# EAGLE schematic v2164 quad VCA (EAGLE 9.5.2)
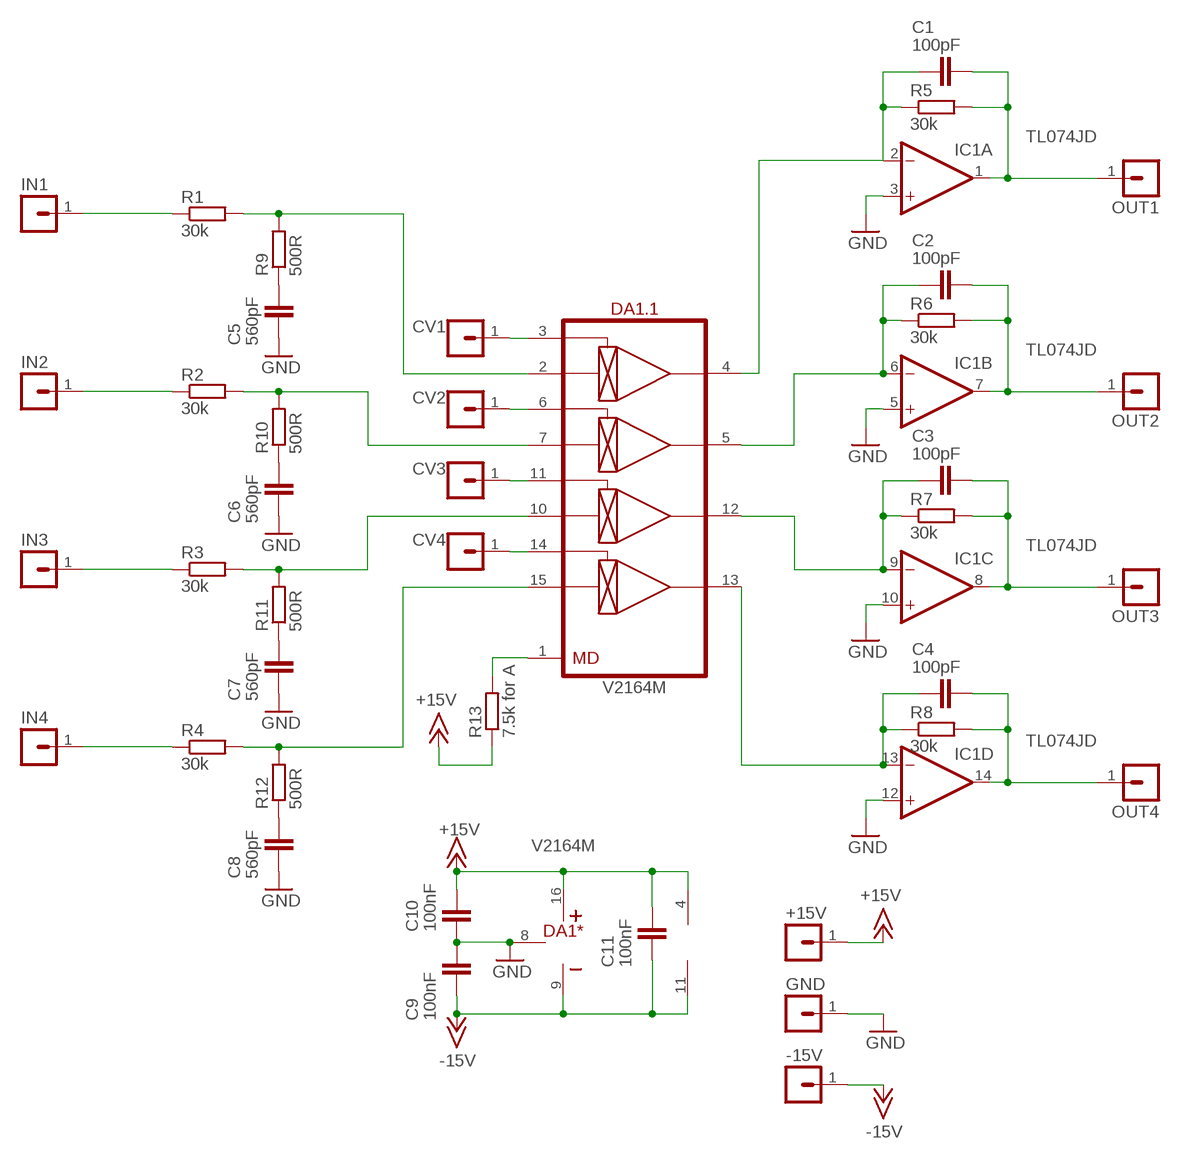
[diagram p0: schematic, sheet 1]

## Parts
+15V  MA01-1JN  [MA01N-1J]
-15V  MA01-1JN  [MA01N-1J]
C1  100pF  C-EUC0603  [C0603]
C2  100pF  C-EUC0603  [C0603]
C3  100pF  C-EUC0603  [C0603]
C4  100pF  C-EUC0603  [C0603]
C5  560pF  C-EUC0603  [C0603]
C6  560pF  C-EUC0603  [C0603]
C7  560pF  C-EUC0603  [C0603]
C8  560pF  C-EUC0603  [C0603]
C9  100nF  C-EUC0603  [C0603]
C10  100nF  C-EUC0603  [C0603]
C11  100nF  C-EUC0603  [C0603]
CV1  MA01-1JN  [MA01N-1J]
CV2  MA01-1JN  [MA01N-1J]
CV3  MA01-1JN  [MA01N-1J]
CV4  MA01-1JN  [MA01N-1J]
DA1  V2164M  [SO-16]
GND  MA01-1JN  [MA01N-1J]
IC1  TL074JD  [SO14J]
IN1  MA01-1JN  [MA01N-1J]
IN2  MA01-1JN  [MA01N-1J]
IN3  MA01-1JN  [MA01N-1J]
IN4  MA01-1JN  [MA01N-1J]
OUT1  MA01-1JN  [MA01N-1J]
OUT2  MA01-1JN  [MA01N-1J]
OUT3  MA01-1JN  [MA01N-1J]
OUT4  MA01-1JN  [MA01N-1J]
R1  30k  R-EU_R0603  [R0603]
R2  30k  R-EU_R0603  [R0603]
R3  30k  R-EU_R0603  [R0603]
R4  30k  R-EU_R0603  [R0603]
R5  30k  R-EU_R0603  [R0603]
R6  30k  R-EU_R0603  [R0603]
R7  30k  R-EU_R0603  [R0603]
R8  30k  R-EU_R0603  [R0603]
R9  500R  R-EU_R0603  [R0603]
R10  500R  R-EU_R0603  [R0603]
R11  500R  R-EU_R0603  [R0603]
R12  500R  R-EU_R0603  [R0603]
R13  7.5k for A  R-EU_R0603  [R0603]

## Nets
+15V: +15V.1 C10.2 C11.2 DA1.16(*:V+) IC1.4(P:V+) R13.1
-15V: -15V.1 C9.1 C11.1 DA1.9(*:V-) IC1.11(P:V-)
CV1: CV1.1 DA1.3(.1:CV1)
CV2: CV2.1 DA1.6(.1:CV2)
CV3: CV3.1 DA1.11(.1:CV3)
CV4: CV4.1 DA1.14(.1:CV4)
GND: C5.1 C6.1 C7.1 C8.1 C9.2 C10.1 DA1.8(*:GND) GND.1 IC1.3(A:+IN) IC1.5(B:+IN) IC1.10(C:+IN) IC1.12(D:+IN)
IN1: IN1.1 R1.1
IN2: IN2.1 R2.1
IN3: IN3.1 R3.1
IN4: IN4.1 R4.1
N$1: C4.1 DA1.13(.1:OUT4) IC1.13(D:-IN) R8.1
N$2: DA1.1(.1:MD) R13.2
N$3: C3.1 DA1.12(.1:OUT3) IC1.9(C:-IN) R7.1
N$5: C2.1 DA1.5(.1:OUT2) IC1.6(B:-IN) R6.1
N$7: C1.1 DA1.4(.1:OUT1) IC1.2(A:-IN) R5.1
N$9: C5.2 R9.1
N$10: C6.2 R10.1
N$11: C7.2 R11.1
N$12: C8.2 R12.1
N$17: DA1.2(.1:IN1) R1.2 R9.2
N$18: DA1.7(.1:IN2) R2.2 R10.2
N$19: DA1.10(.1:IN3) R3.2 R11.2
N$20: DA1.15(.1:IN4) R4.2 R12.2
OUT1: C1.2 IC1.1(A:OUT) OUT1.1 R5.2
OUT2: C2.2 IC1.7(B:OUT) OUT2.1 R6.2
OUT3: C3.2 IC1.8(C:OUT) OUT3.1 R7.2
OUT4: C4.2 IC1.14(D:OUT) OUT4.1 R8.2

## Library data of the parts
+15V -15V CV1-CV4 GND IN1-IN4 OUT1-OUT4 = joakim:MA01-1J: PIN HEADER
C1-C11 = rcl:C-EU: CAPACITOR, European symbol; SPICEPREFIX: C
DA1 = ic-coolaudio:V2164
IC1 = joakim:TL074J: OP AMP
R1-R13 = rcl:R-EU_: RESISTOR, European symbol; SPICEPREFIX: R